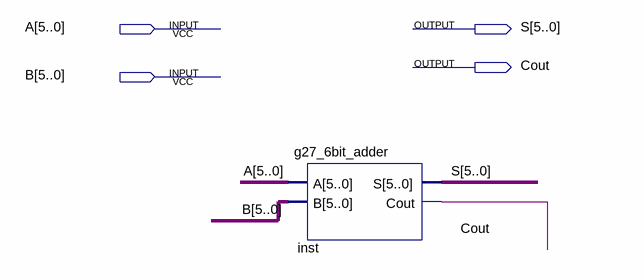
[diagram p0: schematic sheet]
// Quartus schematic g27_6bit_adder_b.bdf as structural Verilog: 1 symbols, 4 pins
module g27_6bit_adder_b (
  input  [5:0] A,
  input  [5:0] B,
  output [5:0] S,
  output Cout
);

  g27_6bit_adder inst (.A(A), .B(B), .S(S), .Cout(Cout));
endmodule
